# Altium schematic sheet 电源部分.SchDoc
size A4
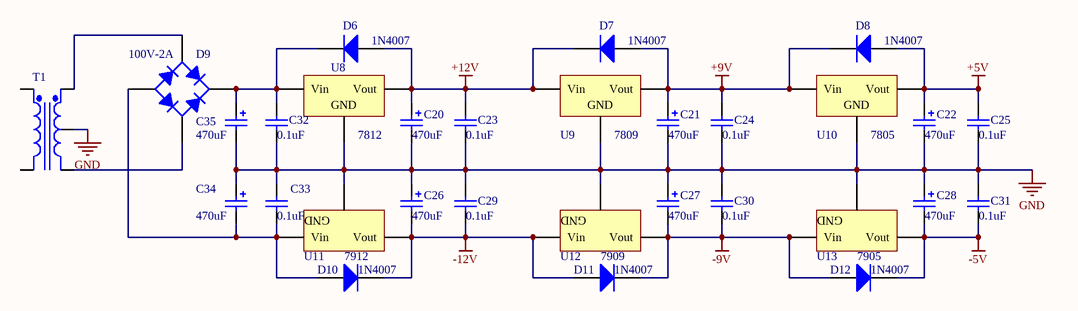
[diagram p0: 电源部分.SchDoc]

## Parts
C20  (no value)  [电解电容]
C21  (no value)  [电解电容]
C22  (no value)  [电解电容]
C23  瓷片电容  [瓷片电容]  (value not drawn)
C24  瓷片电容  [瓷片电容]  (value not drawn)
C25  瓷片电容  [瓷片电容]  (value not drawn)
C26  (no value)  [电解电容]
C27  (no value)  [电解电容]
C28  (no value)  [电解电容]
C29  瓷片电容  [瓷片电容]  (value not drawn)
C30  瓷片电容  [瓷片电容]  (value not drawn)
C31  瓷片电容  [瓷片电容]  (value not drawn)
C32  瓷片电容  [瓷片电容]  (value not drawn)
C33  瓷片电容  [瓷片电容]  (value not drawn)
C34  (no value)  [电解电容]
C35  (no value)  [电解电容]
D6  1N4007  [DO-41]
D7  1N4007  [DO-41]
D8  1N4007  [DO-41]
D9  100V-2A  [D-38]
D10  1N4007  [DO-41]
D11  1N4007  [DO-41]
D12  1N4007  [DO-41]
T1  Trans CT  [TRF_5]  (value not drawn)
U8  7812  [78**]
U9  7809  [78**]
U10  7805  [78**]
U11  7912  [79**]
U12  7909  [79**]
U13  7905  [79**]

## Nets
+5V: C22.1 C25.2 D8.1(A) U10.3(Vout)
+9V: C21.1 C24.2 D7.1(A) D8.2(K) U9.3(Vout) U10.1(Vin)
+12V: C20.1 C23.2 D6.1(A) D7.2(K) U8.3(Vout) U9.1(Vin)
-5V: C28.2 C31.1 D12.2(K) U13.3(Vout)
-9V: C27.2 C30.1 D11.2(K) D12.1(A) U12.3(Vout) U13.1(Vin)
-12V: C26.2 C29.1 D10.2(K) D11.1(A) U11.3(Vout) U12.1(Vin)
GND: C20.2 C21.2 C22.2 C23.1 C24.1 C25.1 C26.1 C27.1 C28.1 C29.2 C30.2 C31.2 C32.1 C33.2 C34.1 C35.2 T1.4(SecCT) U8.2(GND) U9.2(GND) U10.2(GND) U11.2(GND) U12.2(GND) U13.2(GND)
NetC32_2: C32.2 C35.1 D6.2(K) D9.3(K) U8.1(Vin)
NetC33_1: C33.1 C34.2 D9.1(A) D10.1(A) U11.1(Vin)
NetD9_2: D9.2(C) T1.3(Sec+)
NetD9_4: D9.4(C) T1.5(Sec-)

Not connected (* = marked no-connect by the designer): T1 1(Pri+) 2(Pri-)

## Notes on the sheet
- 标题
- 日期
- 红外数字模拟接收一体机
- 2015 5 29
- 作者
- 模电组
- 单位
- 电子技术协会
- (in symbol 瓷片电容) 0.1uF
- (in symbol 电解电容) 470uF

## Library data of the parts
C20-C22 C26-C28 C34 C35 = 电解电容
D6-D8 D10-D12 = Diode 1N4007: 1 Amp General Purpose Rectifier; Published: 8-Jun-2000; LatestRevisionDate: 17-Jul-2002; LatestRevisionNote: Re-released for DXP Platform.; DatasheetDocument: 1998; PackageDocument: Aug-1999; PackageReference: DO-41; Publisher: Altium Limited; Code_JEDEC: DO-204-AL; ComponentLink1Description: Manufacturer Link; ComponentLink1URL: http://www.fairchildsemi.com/; ComponentLink2Description: Datasheet; ComponentLink2URL: http://www.fairchildsemi.com/ds/1N%2F1N4001.pdf
D9 = Bridge1: Full Wave Diode Bridge; Published: 8-Jun-2000; LatestRevisionDate: 17-Jul-2002; LatestRevisionNote: Re-released for DXP Platform.; PackageReference: D-38; Publisher: Altium Limited
T1 = Trans CT: Center-Tapped Transformer (Coupled Inductor Model); Published: 8-Jun-2000; LatestRevisionDate: 17-Jul-2002; LatestRevisionNote: Re-released for DXP Platform.; PackageReference: TRF_5; Publisher: Altium Limited
U8-U13 = Volt Reg: Voltage Regulator; Published: 24-Mar-1999; LatestRevisionDate: 17-Jul-2002; LatestRevisionNote: Re-released for DXP Platform.; PackageReference: D2PAK; Publisher: Altium Limited; Code_JEDEC: SMD-220